# Altium project TS-IC LM62.PrjPcb
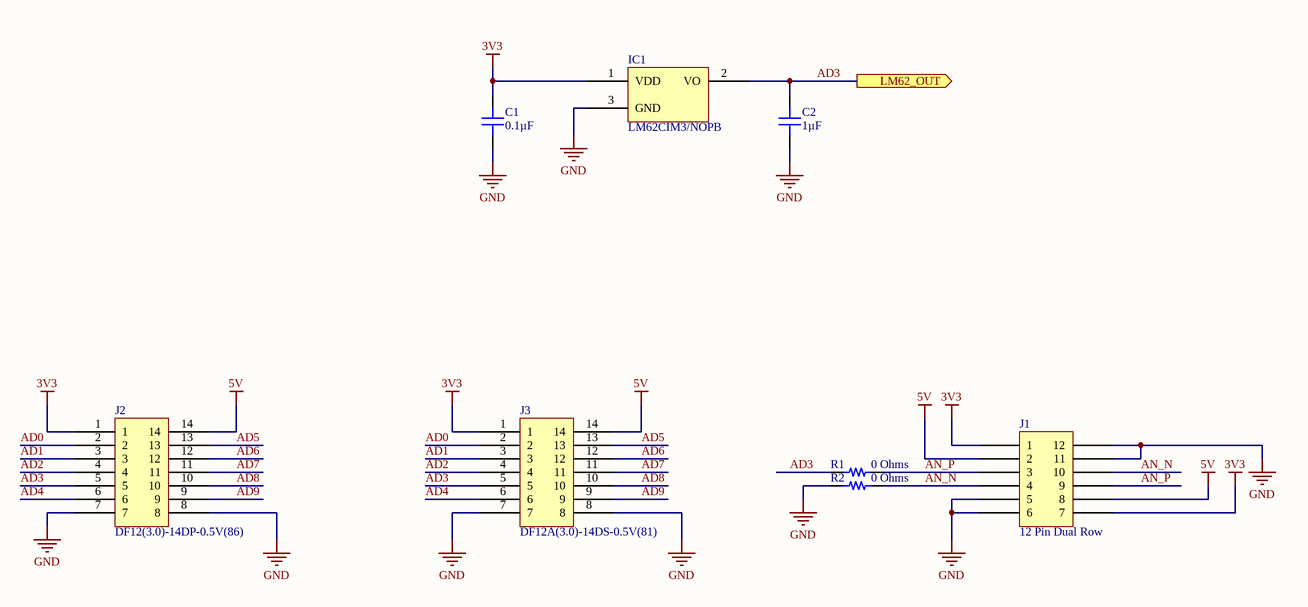
[diagram p0: LM62.SchDoc]
1 sheet, 8 parts. Net scope: flat (ports and power ports of the same name join across sheets).
Board file: LM62 Card.PcbDoc

## Sheet LM62.SchDoc: Analog Temperature Sensor
size A4

### Parts
C1  0.1µF  [CAP 0603_1608]
C2  1µF  [CAP 0603_1608]
IC1  LM62CIM3/NOPB  [TI SOT-23-3 DBZ]
J1  12 Pin Dual Row  [TE 5650118-3 Card Edge]
J2  DF12(3.0)-14DP-0.5V(86)  [HIROSE DF12 3.0-14DP-0.5V 86]
J3  DF12A(3.0)-14DS-0.5V(81)  [HIROSE DF12A 3.0-14DS-0.5V 81]
R1  0 Ohms  [RES 0603_1608]
R2  0 Ohms  [RES 0603_1608]

### Ports
LM62_OUT (out)

### Nets
3V3: C1.1 IC1.1(VDD) J1.1 J1.7 J2.1 J3.1
5V: J1.2 J1.8 J2.14 J3.14
GND: C1.2 C2.1 IC1.3(GND) J1.5 J1.6 J1.11 J1.12 J2.7 J2.8 J3.7 J3.8 R2.1
AD0: J2.2 J3.2
AD1: J2.3 J3.3
AD2: J2.4 J3.4
AD3: C2.2 IC1.2(VO) J2.5 J3.5 R1.1 ; port LM62_OUT
AD4: J2.6 J3.6
AD5: J2.13 J3.13
AD6: J2.12 J3.12
AD7: J2.11 J3.11
AD8: J2.10 J3.10
AD9: J2.9 J3.9
AN_N: J1.4 J1.10 R2.2
AN_P: J1.3 J1.9 R1.2

### Notes on the sheet
- Title
- Size:
- Date:
- A4
- Number:
- Time:
- Revision:
- Sheet
- of
- File:

### Library data of the parts
C1 = CC0603ZRY5V7BB104: CAP CER 0.1UF 16V Y5V 0603; Manufacturer: Yageo; Temperature Coefficient: Y5V (F); Tolerance: -20%, +80%; Part Number: CC0603ZRY5V7BB104; Value: 0.1µF; Applications: General Purpose; Capacitance: 0.1µF; ComponentLink1Description: Datasheet; ComponentLink1URL: http://www.yageo.com/documents/recent/UPY-GPHC_Y5V_6.3V-to-50V_8.pdf; ComponentLink2Description: DigiKey Link; ComponentLink2URL: http://digikey.com/product-detail/en/yageo/CC0603ZRY5V7BB104/311-1369-1-ND/2103153; Device Package: 0603 (1608 Metric); LastUpdated: 21/01/2020 00:01:38; Lifecycle Status: Active; Minimum Order: 1; Mounting Type: Surface Mount, MLCC; Operating Temperature: -30°C ~ 85°C; Package / Case: 0603 (1608 Metric); Packaging: TapeAndReel; PartId: 17881; Part Status: Active; Price: 0.01; Series: CC; Size / Dimension: 0.063" L x 0.031" W (1.60mm x 0.80mm); Supplier 1: DigiKey; Supplier Part Number 1: 311-1369-1-ND; Thickness (Max): 0.035" (0.90mm); Voltage - Rated: 16V
C2 = CC0603KRX5R8BB105: CAP CER 1UF 25V X5R 0603; Manufacturer: Yageo; Tolerance: ±10%; Part Number: CC0603KRX5R8BB105; Value: 1µF; Applications: General Purpose; Capacitance: 1µF; ComponentLink1Description: Datasheet; ComponentLink1URL: https://www.yageo.com/upload/media/product/productsearch/datasheet/mlcc/UPY-GPHC_X5R_4V-to-50V_25.pdf; ComponentLink2Description: DigiKey Link; ComponentLink2URL: http://digikey.com/product-detail/en/yageo/CC0603KRX5R8BB105/311-1445-1-ND/2833751; Device Package: 0603 (1608 Metric); LastUpdated: 02/09/2020 01:03:31; Lifecycle Status: Active; Minimum Order: 1; Mounting Type: Surface Mount, MLCC; Operating Temperature: -55°C ~ 85°C; Package / Case: 0603 (1608 Metric); Packaging: TapeAndReel; PartId: 5146; Part Status: Active; Price: 0.01; Series: CC; Size / Dimension: 0.063" L x 0.031" W (1.60mm x 0.80mm); Supplier 1: DigiKey; Supplier Part Number 1: 311-1445-1-ND; Temperature Coefficient: X5R; Thickness (Max): 0.035" (0.90mm); Voltage - Rated: 25V
IC1 = LM62CIM3/NOPB: SENSOR ANALOG 0C-90C SOT23-3; Manufacturer: Texas Instruments; Accuracy - Highest (Lowest): ±3°C (±4°C); Output Type: Analog Voltage; Resolution: 15.6mV/°C; Sensing Temperature - Local: 0°C ~ 90°C; Sensor Type: Analog, Local; Test Condition: 25°C (0°C ~ 90°C); Voltage - Supply: 2.7V ~ 10V; Part Number: LM62CIM3/NOPB; ComponentLink1Description: Datasheet; ComponentLink1URL: http://www.ti.com/general/docs/suppproductinfo.tsp?distId=10&gotoUrl=http%3A%2F%2Fwww.ti.com%2Flit%2Fgpn%2Flm62; ComponentLink2Description: DigiKey Link; ComponentLink2URL: http://digikey.com/product-detail/en/texas-instruments/LM62CIM3-NOPB/LM62CIM3-NOPBCT-ND/364228; Device Package: TO-236-3, SC-59, SOT-23-3; Features: Shutdown Mode; LastUpdated: 25/05/2020 18:06:19; Lifecycle Status: Active; Minimum Order: 1; Mounting Type: Surface Mount; Operating Temperature: 0°C ~ 90°C; Package / Case: TO-236-3, SC-59, SOT-23-3; Packaging: TapeAndReel; Part Status: Active; Price: 0.45; Supplier 1: DigiKey; Supplier Part Number 1: LM62CIM3/NOPBCT-ND; Supplier Device Package: SOT-23-3
J2 = DF12(3.0)-14DP-0.5V(86): CONN HDR 14POS SMD GOLD; Manufacturer: Hirose Electric Co Ltd; Connector Type: Header, Outer Shroud Contacts; Mated Stacking Heights: 3mm; Number of Positions: 14; Pitch: 0.020" (0.50mm); Part Number: DF12(3.0)-14DP-0.5V(86); ComponentLink1Description: Datasheet; ComponentLink1URL: https://www.hirose.com/product/download/?distributor=digikey&type=specSheet&lang=en&num=DF12(3.0)-14DP-0.5V(86); ComponentLink2Description: DigiKey Link; ComponentLink2URL: http://digikey.com/product-detail/en/hirose-electric-co-ltd/DF12-3.0-14DP-0.5V-86/H11701CT-ND/2172493; Contact Finish: Gold; Contact Finish Thickness: 8.00µin (0.203µm); Features: Board Guide, Solder Retention; Height Above Board: 0.091" (2.30mm); LastUpdated: 06/08/2020 22:47:47; Lifecycle Status: Active; Minimum Order: 1; Mounting Type: Surface Mount; Number of Rows: 2; Packaging: TapeAndReel; Part Status: Active; Price: 0.38; Series: DF12; Supplier 1: DigiKey; Supplier Part Number 1: H11701CT-ND
J3 = DF12A(3.0)-14DS-0.5V(81): CONN RCPT 14POS SMD GOLD; Manufacturer: Hirose Electric Co Ltd; Connector Type: Receptacle, Center Strip Contacts; Mated Stacking Heights: 3mm; Number of Positions: 14; Pitch: 0.020" (0.50mm); Part Number: DF12A(3.0)-14DS-0.5V(81); ComponentLink1Description: Datasheet; ComponentLink1URL: https://www.hirose.com/product/document?clcode=CL0537-0721-0-86&productname=DF12(3.0)-10DP-0.5V(86)&series=DF12&documenttype=Catalog&lang=en&documentid=D31693_en; ComponentLink2Description: DigiKey Link; ComponentLink2URL: http://digikey.com/product-detail/en/hirose-electric-co-ltd/DF12A-3.0-14DS-0.5V-81/H11713CT-ND/2172505; Contact Finish: Gold; Contact Finish Thickness: 8.00µin (0.203µm); Features: Board Guide; Height Above Board: 0.087" (2.20mm); LastUpdated: 06/08/2020 22:48:47; Lifecycle Status: Active; Minimum Order: 1; Mounting Type: Surface Mount; Number of Rows: 2; Packaging: TapeAndReel; Part Status: Active; Price: 0.36; Series: DF12; Supplier 1: DigiKey; Supplier Part Number 1: H11713CT-ND
R1 R2 = ERJ-3GEY0R00V: RES SMD 0 OHM JUMPER 1/10W 0603; Manufacturer: Panasonic Electronic Components; Power (Watts): 0.1W, 1/10W; Part Number: ERJ-3GEY0R00V; Value: 0 Ohms; ComponentLink1Description: Datasheet; ComponentLink1URL: http://industrial.panasonic.com/www-cgi/jvcr13pz.cgi?E+PZ+3+AOA0001+ERJ3GEY0R00V+7+WW; ComponentLink2Description: DigiKey Link; ComponentLink2URL: http://digikey.com/product-detail/en/panasonic-electronic-components/ERJ-3GEY0R00V/P0.0GCT-ND/134711; Composition: Thick Film; Device Package: 0603 (1608 Metric); Features: Automotive AEC-Q200; Height - Seated (Max): 0.022" (0.55mm); LastUpdated: 13/08/2020 10:36:40; Lifecycle Status: Active; Minimum Order: 1; Number of Terminations: 2; Operating Temperature: -55°C ~ 155°C; Package / Case: 0603 (1608 Metric); Packaging: CutTape; PartId: 22603; Part Status: Active; Price: 0.10; Ratings: AEC-Q200; Resistance: 0 Ohms; Series: ERJ; Size / Dimension: 0.063" L x 0.031" W (1.60mm x 0.80mm); Supplier 1: DigiKey; Supplier Part Number 1: P0.0GCT-ND; Supplier Device Package: 0603; Tolerance: Jumper